# Altium schematic sheet BLE112.SchDoc
size A4
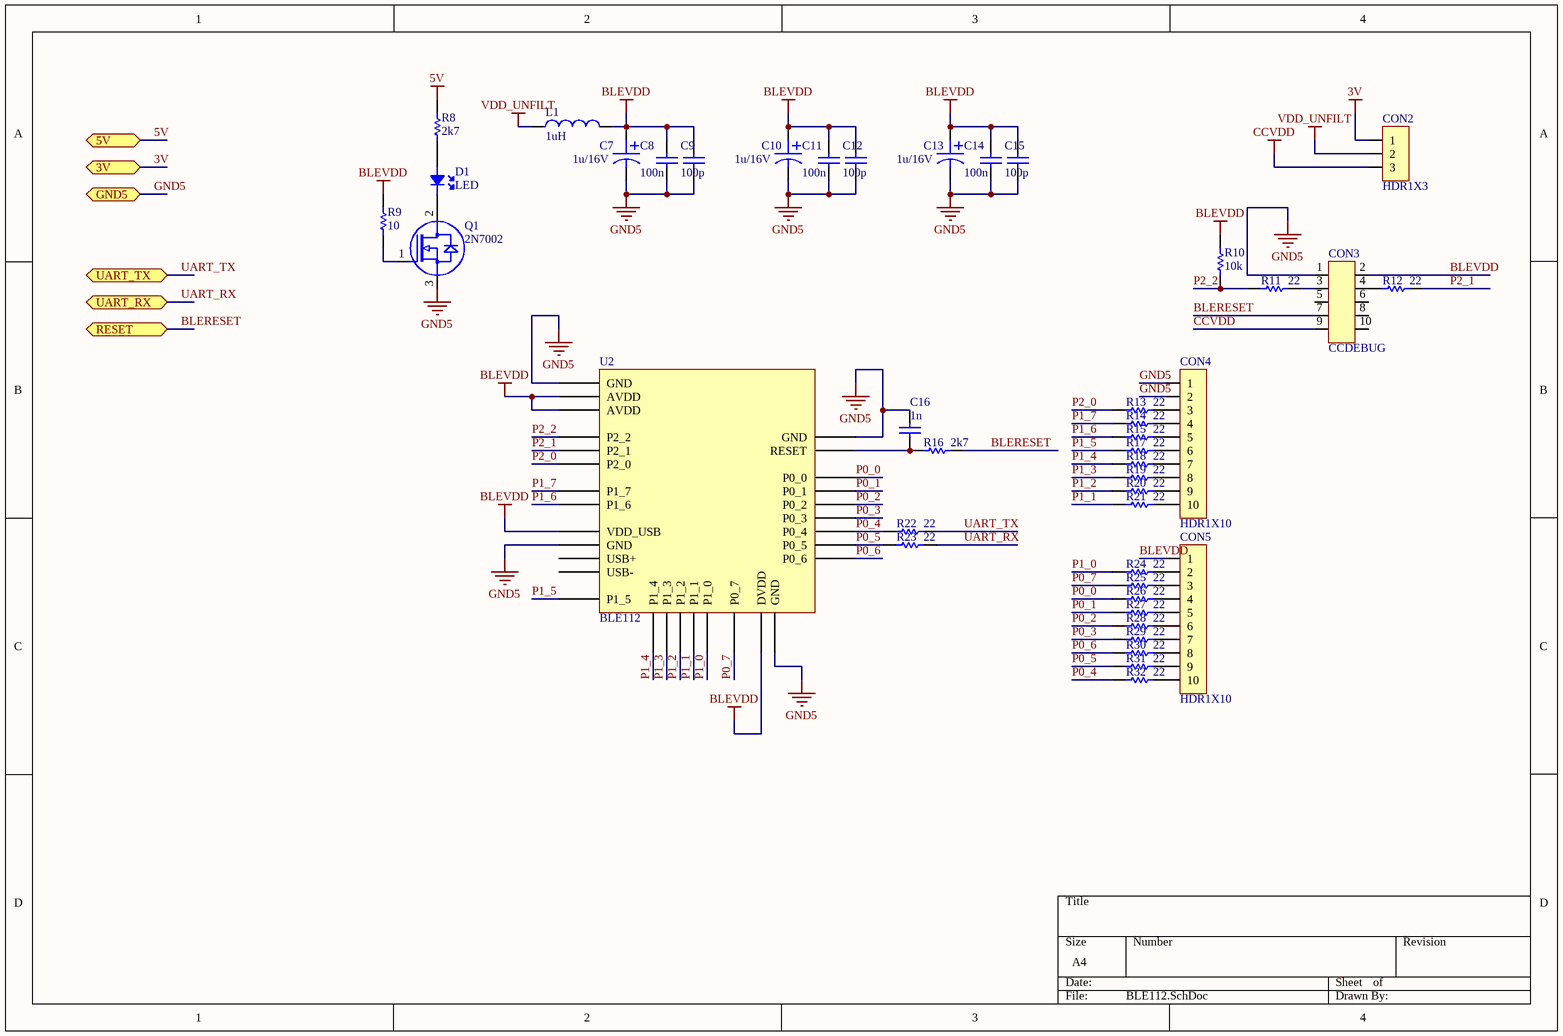
[diagram p0: BLE112.SchDoc]

## Parts
C7  1u/16V  [CA]
C8  100n  [0805C]
C9  100p  [0805C]
C10  1u/16V  [CA]
C11  100n  [0805C]
C12  100p  [0805C]
C13  1u/16V  [CA]
C14  100n  [0805C]
C15  100p  [0805C]
C16  1n  [0805C]
CON2  HDR1X3  [HDR1X3RAST]
CON3  CCDEBUG  [HDR2X5_CC]
CON4  HDR1X10  [HDR1X10RAST]
CON5  HDR1X10  [HDR1X10RAST]
D1  LED  [0805LED]
L1  1uH  [0805L]
Q1  2N7002  [SOT23]
R8  2k7  [0805R]
R9  10  [0805R]
R10  10k  [0805R]
R11  22  [0805R]
R12  22  [0805R]
R13  22  [0805R]
R14  22  [0805R]
R15  22  [0805R]
R16  2k7  [0805R]
R17  22  [0805R]
R18  22  [0805R]
R19  22  [0805R]
R20  22  [0805R]
R21  22  [0805R]
R22  22  [0805R]
R23  22  [0805R]
R24  22  [0805R]
R25  22  [0805R]
R26  22  [0805R]
R27  22  [0805R]
R28  22  [0805R]
R29  22  [0805R]
R30  22  [0805R]
R31  22  [0805R]
R32  22  [0805R]
U2  BLE112  [BLE112]

## Ports
3V, 5V, GND5, RESET, UART_RX, UART_TX

## Nets
3V: CON2.1 ; port 3V
5V: R8.2 ; port 5V
BLEVDD: C7.1 C8.2 C9.2 C10.1 C11.2 C12.2 C13.1 C14.2 C15.2 CON3.2 CON5.1 L1.2 R9.2 R10.1 U2.AVDD U2.DVDD U2.VDD_USB
CCVDD: CON2.3 CON3.9
GND5: C7.2 C8.1 C9.1 C10.2 C11.1 C12.1 C13.2 C14.1 C15.1 C16.2 CON3.1 CON4.1 CON4.2 Q1.3(SOURCE) U2.GND ; port GND5
VDD_UNFILT: CON2.2 L1.1
BLERESET: CON3.7 R16.1 ; port RESET
P0_0: R26.2 U2.P0_0
P0_1: R27.2 U2.P0_1
P0_2: R28.2 U2.P0_2
P0_3: R29.2 U2.P0_3
P0_4: R22.2 R32.2 U2.P0_4
P0_5: R23.2 R31.2 U2.P0_5
P0_6: R30.2 U2.P0_6
P0_7: R25.2 U2.P0_7
P1_0: R24.2 U2.P1_0
P1_1: R21.2 U2.P1_1
P1_2: R20.2 U2.P1_2
P1_3: R19.2 U2.P1_3
P1_4: R18.2 U2.P1_4
P1_5: R17.2 U2.P1_5
P1_6: R15.2 U2.P1_6
P1_7: R14.2 U2.P1_7
P2_0: R13.2 U2.P2_0
P2_1: R12.1 U2.P2_1
P2_2: R10.2 R11.2 U2.P2_2
UART_RX: R23.1 ; port UART_RX
UART_TX: R22.1 ; port UART_TX
NetC16_1: C16.1 R16.2 U2.RESET
NetCON3_3: CON3.3 R11.1
NetCON3_4: CON3.4 R12.2
NetCON4_3: CON4.3 R13.1
NetCON4_4: CON4.4 R14.1
NetCON4_5: CON4.5 R15.1
NetCON4_6: CON4.6 R17.1
NetCON4_7: CON4.7 R18.1
NetCON4_8: CON4.8 R19.1
NetCON4_9: CON4.9 R20.1
NetCON4_10: CON4.10 R21.1
NetCON5_2: CON5.2 R24.1
NetCON5_3: CON5.3 R25.1
NetCON5_4: CON5.4 R26.1
NetCON5_5: CON5.5 R27.1
NetCON5_6: CON5.6 R28.1
NetCON5_7: CON5.7 R29.1
NetCON5_8: CON5.8 R30.1
NetCON5_9: CON5.9 R31.1
NetCON5_10: CON5.10 R32.1
NetD1_1: D1.1(A) R8.1
NetD1_2: D1.2(K) Q1.2(DRAIN)
NetQ1_1: Q1.1(GATE) R9.1

Not connected (* = marked no-connect by the designer): CON3 5 6 8 10; U2 USB+ USB-

## Library data of the parts
C7 C10 C13 = ELECTROLYTIC_CAPACITOR: Value: 1u/16V
C8 C9 C11 C12 C14-C16 = CAPACITOR
  C8 C11 C14: Value: 100n
  C9 C12 C15: Value: 100p
  C16: Value: 1n
D1 = LED: COLOR: GREEN
L1 = Inductor: Value: 1uH
R8-R32 = RESISTOR
  R8 R16: Value: 2k7
  R9: Value: 10
  R10: Value: 10k
  R11-R15 R17-R32: Value: 22
Q1 = 2N7002: FARNELL: 2306371
U2 = BLE112: FARNELL: 2113858